# Altium schematic sheet AVR PCB.SchDoc
size 297 x 209 mm
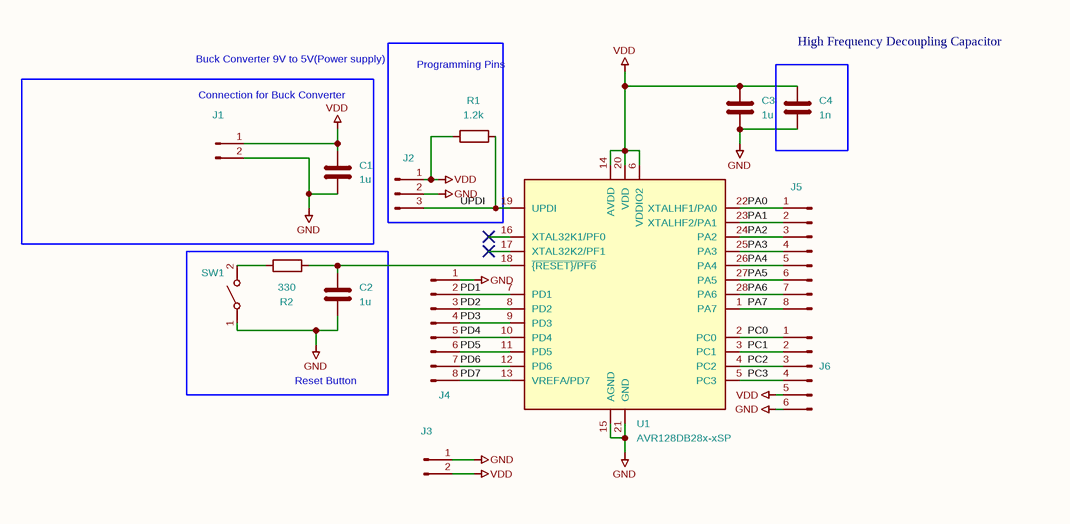
[diagram p0: AVR PCB.SchDoc]

## Parts
C1  1u  [C_Disc_D7.5mm_W2.5mm_P5.00mm]
C2  1u  [C_Disc_D7.5mm_W2.5mm_P5.00mm]
C3  1u  [C_Disc_D7.5mm_W2.5mm_P5.00mm]
C4  1n  [C_Disc_D7.5mm_W2.5mm_P5.00mm]
J1  Conn_01x02_Pin  [PinHeader_1x02_P2.54mm_Vertical]  (value not drawn)
J2  Conn_01x03_Male  [PinHeader_1x03_P2.54mm_Vertical]  (value not drawn)
J3  Conn_01x02_Male  [PinHeader_1x02_P2.54mm_Vertical]  (value not drawn)
J4  Conn_01x08_Male  [PinHeader_1x08_P2.54mm_Vertical]  (value not drawn)
J5  Conn_01x08_Male  [PinHeader_1x08_P2.54mm_Vertical]  (value not drawn)
J6  Conn_01x06_Male  [PinHeader_1x06_P2.54mm_Vertical]  (value not drawn)
R1  1.2k  [R_Axial_DIN0309_L9.0mm_D3.2mm_P12.70mm_Horizontal]
R2  330  [R_Axial_DIN0309_L9.0mm_D3.2mm_P12.70mm_Horizontal]
SW1  SW_SPST  [SW_PUSH_6mm]  (value not drawn)
U1  AVR128DB28x-xSP  [DIP-28_W7.62mm]

## Blocks framed on the sheet
Programming Pins: J2 R1
High Frequency Decoupling Capacitor: C4
Reset Button: C2 R2 SW1

## Nets
GND: C1.2 C2.2 C3.2 C4.2 J1.2(Pin_2) J2.2(Pin_2) J3.1(Pin_1) J4.1(Pin_1) J6.6(Pin_6) SW1.1(A) U1.15(AGND) U1.21(GND)
VDD: C1.1 C3.1 C4.1 J1.1(Pin_1) J2.1(Pin_1) J3.2(Pin_2) J6.5(Pin_5) R1.1 U1.6(VDDIO2) U1.14(AVDD) U1.20(VDD)
PA0: J5.1(Pin_1) U1.22(XTALHF1/PA0)
PA1: J5.2(Pin_2) U1.23(XTALHF2/PA1)
PA2: J5.3(Pin_3) U1.24(PA2)
PA3: J5.4(Pin_4) U1.25(PA3)
PA4: J5.5(Pin_5) U1.26(PA4)
PA5: J5.6(Pin_6) U1.27(PA5)
PA6: J5.7(Pin_7) U1.28(PA6)
PA7: J5.8(Pin_8) U1.1(PA7)
PC0: J6.1(Pin_1) U1.2(PC0)
PC1: J6.2(Pin_2) U1.3(PC1)
PC2: J6.3(Pin_3) U1.4(PC2)
PC3: J6.4(Pin_4) U1.5(PC3)
PD1: J4.2(Pin_2) U1.7(PD1)
PD2: J4.3(Pin_3) U1.8(PD2)
PD3: J4.4(Pin_4) U1.9(PD3)
PD4: J4.5(Pin_5) U1.10(PD4)
PD5: J4.6(Pin_6) U1.11(PD5)
PD6: J4.7(Pin_7) U1.12(PD6)
PD7: J4.8(Pin_8) U1.13(VREFA/PD7)
UPDI: J2.3(Pin_3) R1.2 U1.19(UPDI)
NetC2_1: C2.1 R2.2 U1.18(~{{RESET}/PF6})
NetR2_1: R2.1 SW1.2(B)

Not connected (* = marked no-connect by the designer): U1 16(XTAL32K1/PF0)* 17(XTAL32K2/PF1)*

## Notes on the sheet
- Buck Converter 9V to 5V(Power supply)
- Connection for Buck Converter
- 1
- 2
- 3
- 4
- 5
- 6
- A
- B
- C
- D
- Title:
- File: AVR PCB.kicad_sch
- Sheet: /
- KiCad E.D.A.  kicad (5.1.4)-1
- Size: A4
- Date:
- Rev:
- Id: 1/1

## Library data of the parts
C1-C4 = C: Footprint: Capacitor_THT:C_Disc_D7.5mm_W2.5mm_P5.00mm
  C1-C3: Value: 1u
  C4: Value: 1n
R1 R2 = R: Footprint: Resistor_THT:R_Axial_DIN0309_L9.0mm_D3.2mm_P12.70mm_Horizontal
  R1: Value: 1.2k
  R2: Value: 330
J1 = Conn_01x02_Pin: Value: Conn_01x02_Pin; Footprint: Connector_PinHeader_2.54mm:PinHeader_1x02_P2.54mm_Vertical
J2 = Conn_01x03_Male: Value: Conn_01x03_Male; Footprint: Connector_PinHeader_2.54mm:PinHeader_1x03_P2.54mm_Vertical
J3 = Conn_01x02_Male: Value: Conn_01x02_Male; Footprint: Connector_PinHeader_2.54mm:PinHeader_1x02_P2.54mm_Vertical
J4 J5 = Conn_01x08_Male: Value: Conn_01x08_Male; Footprint: Connector_PinHeader_2.54mm:PinHeader_1x08_P2.54mm_Vertical
J6 = Conn_01x06_Male: Value: Conn_01x06_Male; Footprint: Connector_PinHeader_2.54mm:PinHeader_1x06_P2.54mm_Vertical
SW1 = SW_SPST: Value: SW_SPST; Footprint: Button_Switch_THT:SW_PUSH_6mm
U1 = AVR128DB28x-xSP: Value: AVR128DB28x-xSP; Footprint: Package_DIP:DIP-28_W7.62mm